# EAGLE design in4_single_v0.2_revB (EAGLE 7.6.0)
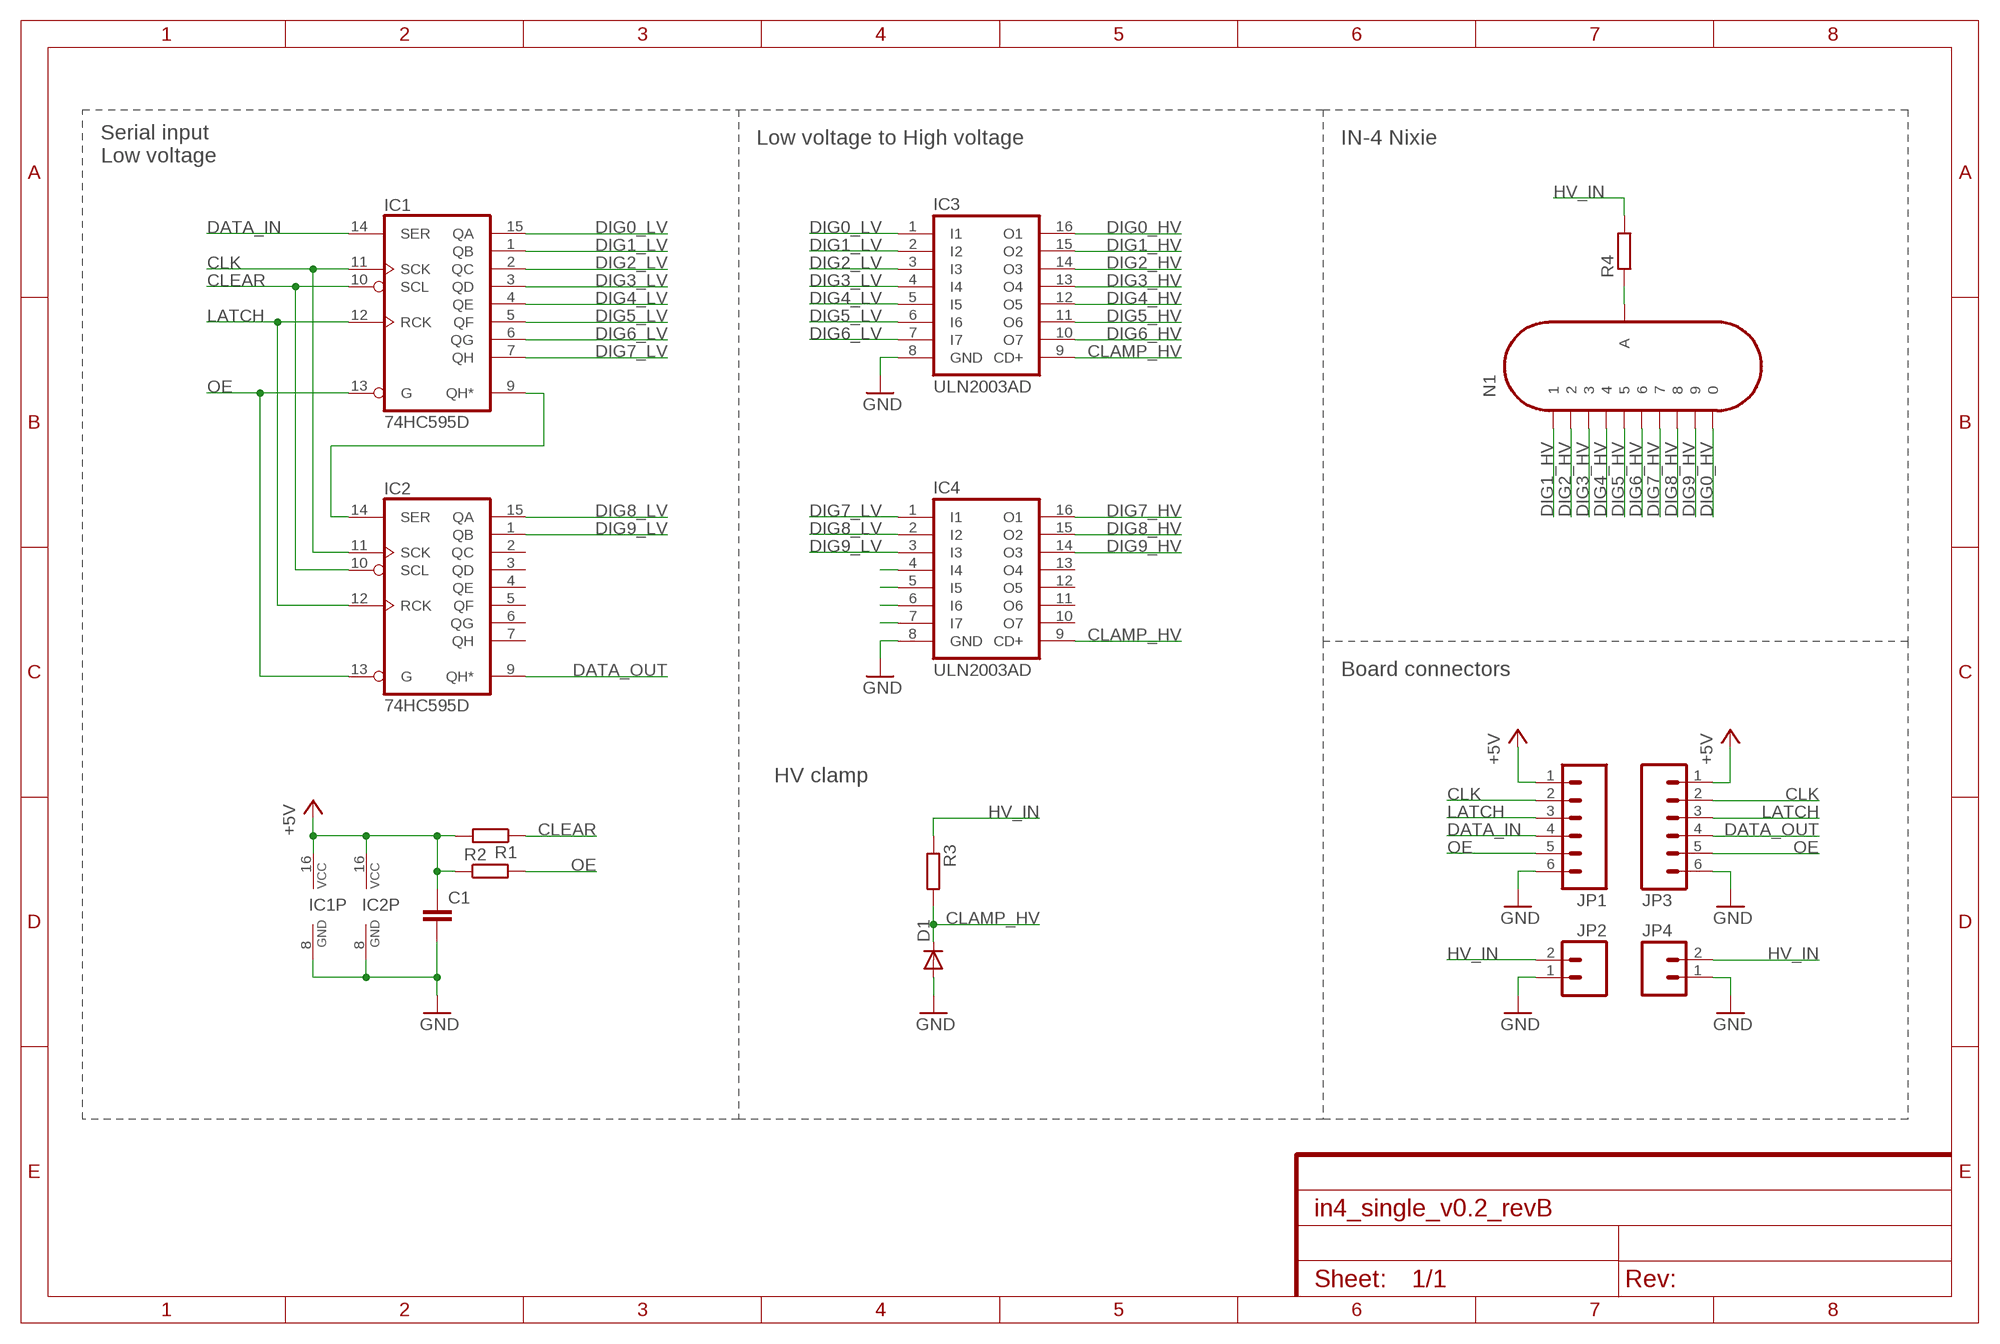
[diagram p0: schematic, sheet 1]
FRAME1 (FRAME-A4L): CNAME: IN4-SINGLE; CREVISION: 0.2 rev B; DESIGNER: Vlad Conut

## Parts
C1  C-EUC0805  [C0805]
D1  DIODE-SOD-123  [SOD-123]
IC1  74HC595D  [SO16]
IC2  74HC595D  [SO16]
IC3  ULN2003AD  [SO16]
IC4  ULN2003AD  [SO16]
JP1  M06NO_SILK_FEMALE_PTH  [1X06_NO_SILK]
JP2  M021X02_NO_SILK  [1X02_NO_SILK]
JP3  M06NO_SILK_FEMALE_PTH  [1X06_NO_SILK]
JP4  M021X02_NO_SILK  [1X02_NO_SILK]
N1  IN-4  [IN-4]
R1  R-EU_R0805  [R0805]
R2  R-EU_R0805  [R0805]
R3  R-EU_R0805  [R0805]
R4  R-EU_R1210  [R1210]

## Nets
+5V: C1.1 IC1.16(VCC) IC2.16(VCC) JP1.1 JP3.1 R1.2 R2.1
CLAMP_HV: D1.C IC3.9(CD+) IC4.9(CD+) R3.2
CLEAR: IC1.10(SCL) IC2.10(SCL) R1.1
CLK: IC1.11(SCK) IC2.11(SCK) JP1.2 JP3.2
DATA_IN: IC1.14(SER) JP1.4
DATA_OUT: IC2.9(QH*) JP3.4
DIG0_HV: IC3.16(O1) N1.8
DIG0_LV: IC1.15(QA) IC3.1(I1)
DIG1_HV: IC3.15(O2) N1.14
DIG1_LV: IC1.1(QB) IC3.2(I2)
DIG2_HV: IC3.14(O3) N1.9
DIG2_LV: IC1.2(QC) IC3.3(I3)
DIG3_HV: IC3.13(O4) N1.11
DIG3_LV: IC1.3(QD) IC3.4(I4)
DIG4_HV: IC3.12(O5) N1.1
DIG4_LV: IC1.4(QE) IC3.5(I5)
DIG5_HV: IC3.11(O6) N1.12
DIG5_LV: IC1.5(QF) IC3.6(I6)
DIG6_HV: IC3.10(O7) N1.2
DIG6_LV: IC1.6(QG) IC3.7(I7)
DIG7_HV: IC4.16(O1) N1.6
DIG7_LV: IC1.7(QH) IC4.1(I1)
DIG8_HV: IC4.15(O2) N1.3
DIG8_LV: IC2.15(QA) IC4.2(I2)
DIG9_HV: IC4.14(O3) N1.5
DIG9_LV: IC2.1(QB) IC4.3(I3)
GND: C1.2 D1.A IC1.8(GND) IC2.8(GND) IC3.8(GND) IC4.8(GND) JP1.6 JP2.1 JP3.6 JP4.1
HV_IN [HV]: JP2.2 JP4.2 R3.1 R4.2
LATCH: IC1.12(RCK) IC2.12(RCK) JP1.3 JP3.3
N$1: IC1.9(QH*) IC2.14(SER)
N$2: IC4.4(I4)
N$3: IC4.7(I7)
N$4: IC4.6(I6)
N$5: IC4.5(I5)
N$11: N1.4(A) R4.1
OE: IC1.13(G) IC2.13(G) JP1.5 JP3.5 R2.2
Unconnected: IC2.2(QC) IC2.3(QD) IC2.4(QE) IC2.5(QF) IC2.6(QG) IC2.7(QH) IC4.10(O7) IC4.11(O6) IC4.12(O5) IC4.13(O4)

## Notes on the sheet
- Low voltage to High voltage | IN-4 Nixie
- Serial input
  Low voltage
- Board connectors
- HV clamp

## Library data of the parts
C1 = rcl:C-EU: CAPACITOR, European symbol
D1 = dp_devices:DIODE: Various Diode Packages
IC1 IC2 = 74xx-eu:74*595: 8-bit SHIFT REGISTER, output latch
IC3 IC4 = uln-udn:ULN2003A: DRIVER ARRAY
JP1 JP3 = SparkFun-Connectors:M06: Header 6 Standard 6-pin 0.1" header. Use with straight break away headers (SKU : PRT-00116), right angle break away headers (PRT-00553), swiss pins (PRT-00743), machine pins (PRT-00117), and female headers (PRT-00115). Molex polarized connector foot print use with SKU : PRT-08094 with associated crimp pins and housings. NOTES ON THE VARIANTS LOCK and LOCK_LONGPADS... This footprint was designed to help hold the alignment of a through-hole component (i.e. 6-pin header) while soldering it into place. You may notice that each hole has been shifted either up or down by 0.005 of an inch from it's more standard position (which is a perfectly straight line). This slight alteration caused the pins (the squares in the middle) to touch the edges of the holes. Because they are alternating, it causes a "brace" to hold the component in place. 0.005 has proven to be the perfect amount of "off-center" position when using our standard breakaway headers. Although looks a little odd when you look at the bare footprint, once you have a header in there, the alteration is very hard to notice. Also,if you push a header all the way into place, it is covered up entirely on the bottom side. This idea of altering the position of holes to aid alignment will be further integrated into the Sparkfun Library for other footprints. It can help hold any component with 3 or more connection pins.; PROD_ID: CONN-08437
JP2 JP4 = SparkFun-Connectors:M02: Standard 2-pin 0.1" header. Use with - straight break away headers ( PRT-00116) - right angle break away headers (PRT-00553) - swiss pins (PRT-00743) - machine pins (PRT-00117) - female headers (PRT-00115) Molex polarized connector foot print use with: PRT-08233 with associated crimp pins and housings. 2.54_SCREWTERM for use with PRT-10571. 3.5mm Screw Terminal footprints for PRT-08084 5mm Screw Terminal footprints for use with PRT-08432
N1 = russian-nixies:IN-4: IN-4: large numeric topview nixie tube
R1-R3 = rcl:R-EU_: RESISTOR, European symbol
R4 = resistor:R-EU_: RESISTOR, European symbol

## Net classes
1 HV: width 0.61 mm, drill 0.33 mm, clearance 0.406 mm

## Board
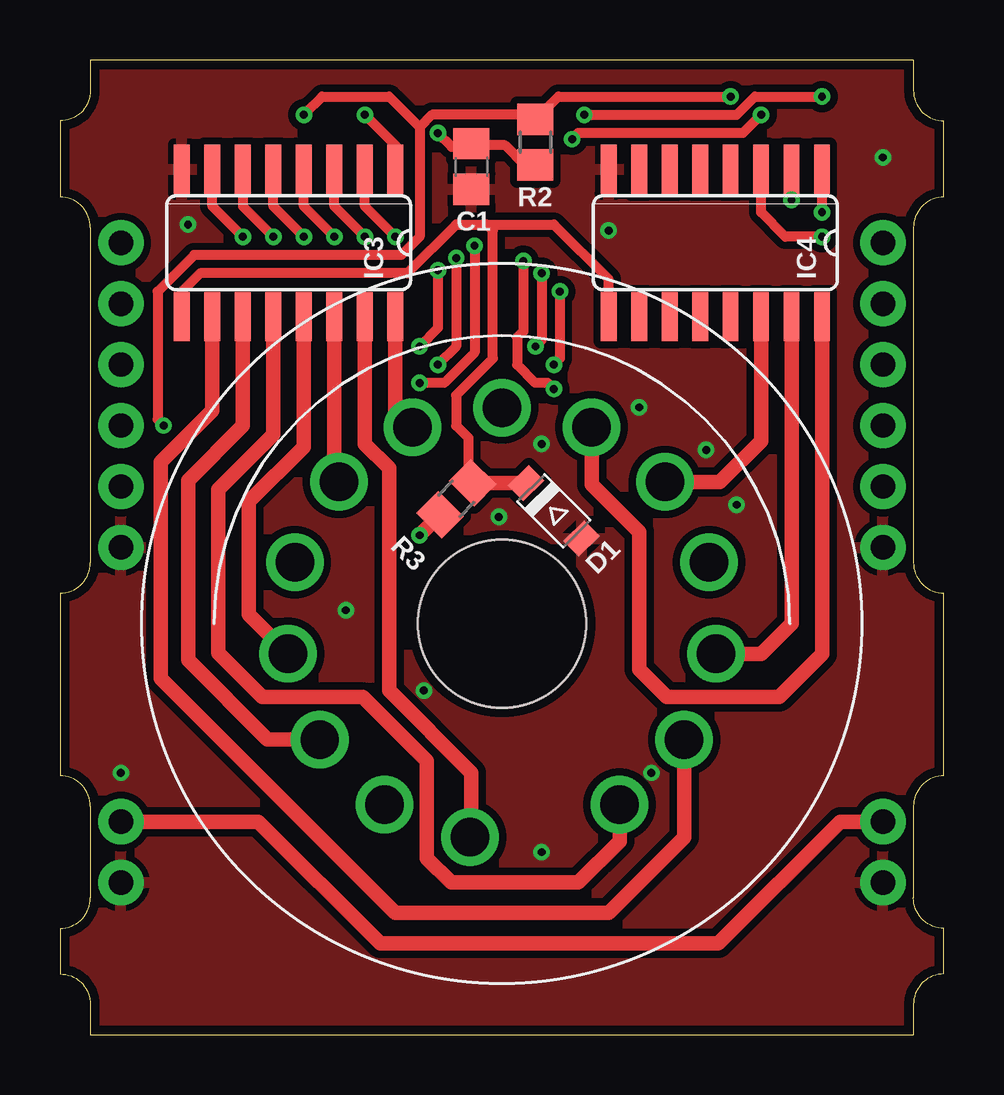
[diagram p1: board, top side]
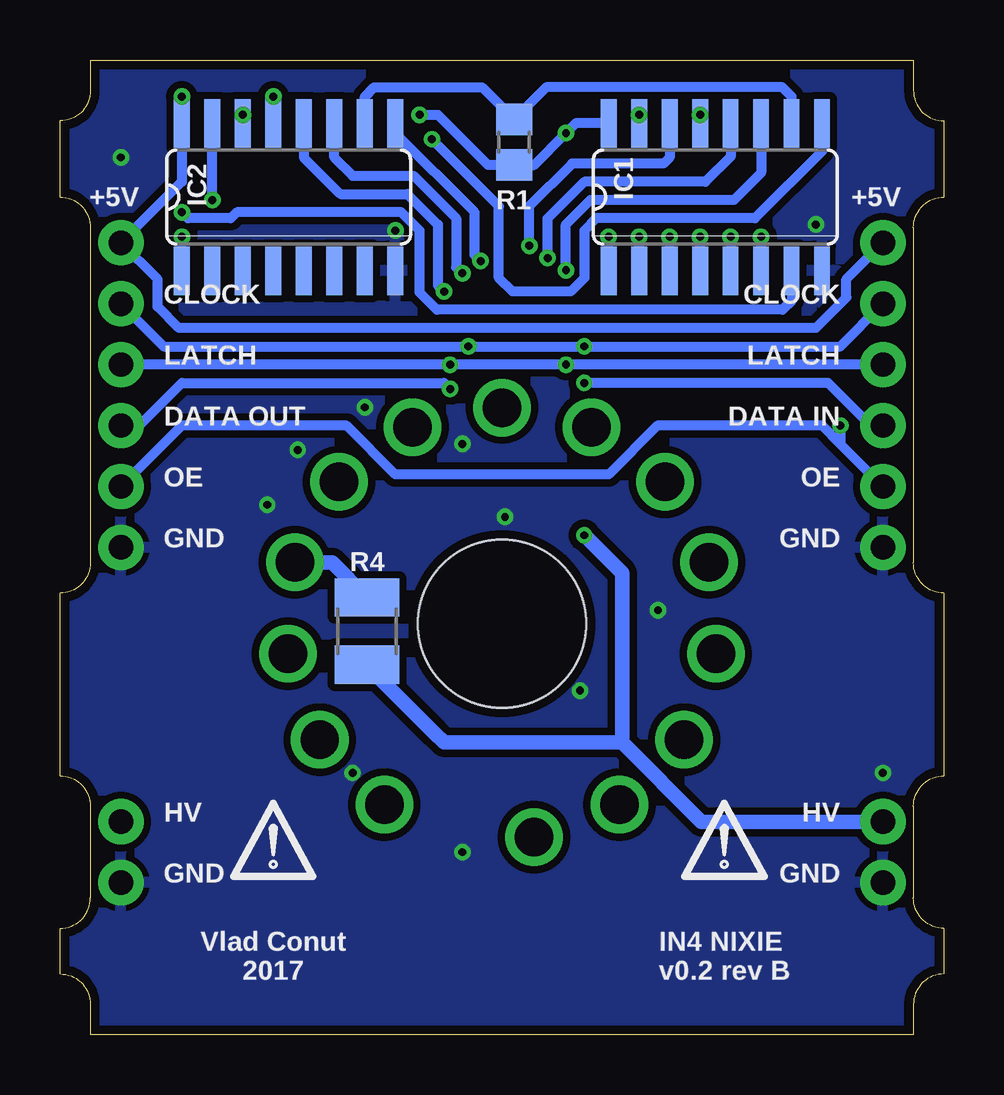
[diagram p2: board, bottom side, seen from below]

Size 36.83 x 40.64 mm. Coordinates in mm from the lower left corner, seen from the top.
Outline: 1.27,0 35.56,0 35.56,1.27 arc-90 36.83,2.54 36.83,4.45 arc-90 35.56,5.71 35.56,9.53 arc-90 36.83,10.79 36.83,18.41 arc-90 35.56,19.68 35.56,33.66 arc-90 36.83,34.92 36.83,38.1 arc-90 35.56,39.37 35.56,40.64 1.27,40.64 1.27,39.37 arc-90 0,38.1 0,34.92 arc-90 1.27,33.66 1.27,19.68 arc-90 0,18.41 0,10.79 arc-90 1.27,9.53 1.27,5.71 arc-90 0,4.45 0,2.54 arc-90 1.27,1.27 1.27,0
Copper layers (1*16): Top 0.0356mm / dielectric 1.5288mm / Bottom 0.0356mm
Design rules "OSHPARK_mod *": minimum track width 6mil, minimum drill 13mil, track to track 6mil, track to pad 6mil, pad to pad 6mil, via to via 6mil, smd to smd 0mil, copper to edge 15mil, drill to drill 6mil, minimum pad ring 10mil, minimum via ring 7mil, stop-mask expansion 3mil, vias tented up to drill 20mil, thermal gap 10mil

### Footprints (pad centres in the part's own frame; a part is rotated, then mirrored left to right if it is on the bottom)
C0805 = smd 1.3 x 1.5: 1 -0.95,0; 2 0.95,0
SOD-123 = smd 0.91 x 1.22: A 1.635,0; C -1.635,0
SO16 = smd 0.66 x 2.032: 1 -4.445,-3.073; 2 -3.175,-3.073; 3 -1.905,-3.073; 4 -0.635,-3.073; 5 0.635,-3.073; 6 1.905,-3.073; 7 3.175,-3.073; 8 4.445,-3.073; 9 4.445,3.073; 10 3.175,3.073; 11 1.905,3.073; 12 0.635,3.073; 13 -0.635,3.073; 14 -1.905,3.073; 15 -3.175,3.073; 16 -4.445,3.073
1X06_NO_SILK = drill 1.016 pad 1.88: 1 0,0; 2 2.54,0; 3 5.08,0; 4 7.62,0; 5 10.16,0; 6 12.7,0
1X02_NO_SILK = drill 1.016 pad 1.88: 1 0,0; 2 2.54,0
IN-4 = drill 1.6: 1 4.902,-7.548; 2 7.59,-4.836; 3 8.912,-1.253; 4 8.629,2.556; 5 6.792,5.904; 6 3.732,8.19; 7 0,9; 8 -3.732,8.19; 9 -6.792,5.904; 10 -8.629,2.556; 11 -8.912,-1.253; 12 -7.59,-4.836; 13 -4.902,-7.548; 14 -1.33,-8.901 | hole 7: 0,0
R0805 = smd 1.3 x 1.5: 1 -0.95,0; 2 0.95,0
R1210 = smd 1.6 x 2.7: 1 -1.4,0; 2 1.4,0

### Placement (x,y rotation side)
C1  17.14,36.2 270 top
D1  20.57,21.84 315 top
IC1  9.53,34.92 0 bottom
IC2  27.3,34.92 0 bottom
IC3  9.53,33.02 180 top
IC4  27.3,33.02 180 top
JP1  2.54,33.02 270 top
JP2  2.54,6.35 90 top
JP3  34.29,33.02 270 top
JP4  34.29,6.35 90 top
N1  18.41,17.14 0 top
R1  17.91,37.21 270 bottom
R2  19.81,37.21 90 top
R3  16.51,22.35 45 top
R4  24.04,16.83 270 bottom
U$1  [DANGER_LOGO]  27.94,7.11 0 bottom
U$2  [DANGER_LOGO]  9.14,7.11 0 bottom

### Tracks (layer width: path | path; a pad name or v marks a point on that pad's centre or on a via)
+5V  (via drill 0.33)
  Top 0.406: v15.75,37.59 16.32,37.02 C1.1 17.21,37.08 18.54,37.08 19.36,36.26 R2.1 | v21.84,38.35 28.19,38.35 28.96,39.12 v31.75,39.12
  Bottom 0.406: v21.84,38.35 21.08,38.35 18.99,36.26 R1.2 17.08,36.26 v15.75,37.59 15.34,38 IC1.16 | JP1.1 4.06,31.5 4.06,30.73 5.33,29.46 31.88,29.46 32.77,30.35 32.77,31.5 JP3.1 31.75,35.56 IC2.16 v31.75,39.12
CLAMP_HV
  Top 0.406: IC4.9 22.86,31.5 20.57,33.78 17.78,33.78 | IC3.9 5.08,30.99 5.84,31.75 14.48,31.75 16.51,33.78 17.78,33.78 | 17.78,33.78 18.03,33.53 18.03,28.19 16.51,26.67 16.51,25.4 17.02,24.89 17.02,23.19 R3.2
  Top 0.61: D1.C 17.2,23 R3.2
CLEAR
  Bottom 0.406: IC2.10 24.13,39.12 23.75,39.5 19.24,39.5 R1.1 16.57,39.5 6.73,39.5 6.35,39.12 IC1.10
CLK  (via drill 0.33)
  Top 0.406: v20.07,31.75 20.07,28.96 v19.81,28.7 | v15.75,31.88 15.75,29.46 v14.99,28.7
  Bottom 0.406: JP3.2 32.51,28.7 v19.81,28.7 v14.99,28.7 4.32,28.7 JP1.2 | v20.07,31.75 20.32,32 20.32,34.04 22.1,35.81 24.64,35.81 25.4,36.58 IC2.11 | IC1.11 7.62,35.93 8.76,34.8 14.73,34.8 15.75,33.78 v15.75,31.88
DATA_IN  (via drill 0.33)
  Top 0.406: v17.27,32.89 17.27,28.45 16,27.18 v14.99,27.18
  Bottom 0.406: JP1.4 3.05,25.4 4.83,27.18 v14.99,27.18 | IC1.14 11.43,36.58 11.68,36.32 15.49,36.32 17.27,34.54 v17.27,32.89
DATA_OUT  (via drill 0.33)
  Top 0.406: v20.57,26.92 20.32,27.18 19.81,27.18 19.05,27.94 19.05,29.08 19.3,29.34 v19.3,32.26
  Bottom 0.406: 22.86,38.1 IC2.9 22.86,37.59 19.56,34.29 19.56,32.51 v19.3,32.26 | JP3.4 33.53,25.4 31.75,27.18 20.83,27.18 v20.57,26.92
DIG0_HV
  Top 0.61: IC3.16 13.97,26.05 N1.8
DIG0_LV  (via drill 0.33)
  Top 0.406: IC3.1 13.97,37.08 v12.7,38.35
  Bottom 0.406: v12.7,38.35 IC1.15
DIG1_HV
  Top 0.61: N1.14 17.14,8.3 17.14,10.92 13.72,14.35 13.72,23.62 12.7,24.64 IC3.15
DIG1_LV  (via drill 0.33)
  Top 0.406: v13.97,33.27 12.7,34.54 IC3.2
  Bottom 0.406: 13.97,31.75 IC1.1 v13.97,33.27
DIG2_HV
  Top 0.61: IC3.14 11.43,23.24 N1.9
DIG2_LV  (via drill 0.33)
  Top 0.406: v12.7,33.27 11.43,34.54 IC3.3
  Bottom 0.406: IC1.2 v12.7,33.27
DIG3_HV
  Top 0.61: N1.11 7.87,17.52 7.87,22.23 10.16,24.51 IC3.13
DIG3_LV  (via drill 0.33)
  Top 0.406: v11.43,33.27 10.16,34.54 IC3.4
  Bottom 0.406: IC1.3 v11.43,33.27
DIG4_HV
  Top 0.61: N1.1 23.32,8.08 21.59,6.35 16.31,6.35 15.29,7.37 15.29,11.43 12.62,14.1 8.43,14.1 6.6,15.93 6.6,22.73 8.89,25.02 IC3.12
DIG4_LV  (via drill 0.33)
  Top 0.406: v10.16,33.27 8.89,34.54 IC3.5
  Bottom 0.406: IC1.4 v10.16,33.27
DIG5_HV
  Top 0.61: IC3.11 7.62,25.4 5.33,23.11 5.33,15.62 8.65,12.31 N1.12
DIG5_LV  (via drill 0.33)
  Top 0.406: IC3.6 7.62,34.54 v8.89,33.27
  Bottom 0.406: v8.89,33.27 IC1.5
DIG6_HV
  Top 0.61: IC3.10 6.35,26.04 4.19,23.88 4.19,14.86 13.97,5.08 22.86,5.08 26.01,8.23 N1.2
DIG6_LV  (via drill 0.33)
  Top 0.406: IC3.7 6.35,34.54 v7.62,33.27
  Bottom 0.406: IC1.6 v7.62,33.27
DIG7_HV
  Top 0.61: IC4.16 31.75,15.88 29.97,14.1 25.27,14.1 24.13,15.24 24.13,20.95 22.15,22.94 N1.6
DIG7_LV  (via drill 0.33)
  Top 0.406: v31.75,34.29 IC4.1
  Bottom 0.406: v31.75,34.29 31.5,34.04 29.72,34.04 29.46,34.29 22.61,34.29 21.84,33.53 21.84,30.94 21.13,30.23 6.73,30.23 6.35,30.61 IC1.7
DIG8_HV
  Top 0.61: IC4.15 30.48,17.14 29.21,15.88 27.34,15.88 N1.3
DIG8_LV  (via drill 0.33)
  Top 0.406: IC4.2 v30.48,34.8
  Bottom 0.406: v30.48,34.8 IC2.15
DIG9_HV
  Top 0.61: IC4.14 29.21,24.77 27.49,23.05 N1.5
DIG9_LV  (via drill 0.33)
  Top 0.406: IC4.3 29.21,34.29 30.23,33.27 v31.75,33.27
  Bottom 0.406: IC2.1 v31.75,33.27
GND  (via drill 0.33)
  other vias: 5.33,33.78 18.29,21.59 2.54,10.92 20.07,7.62 24.64,10.92 34.29,36.58 20.07,24.64 24.13,26.16 26.92,24.38 28.19,22.1 11.91,17.7 15.16,14.35 22.86,33.53
  pour Top (isolate 0.305, rank 6): 0,40.64 36.83,40.64 36.83,0 0,0
  pour Bottom (isolate 0.305): 0,40.64 36.83,40.64 36.83,0 0,0
HV_IN  (via drill 0.33)
  Top 0.61: JP2.2 8.26,8.89 13.34,3.81 27.43,3.81 32.51,8.89 JP4.2 | R3.1 v14.99,20.83
  Bottom 0.61: JP2.2 10.11,8.89 13.41,12.19 | 13.41,12.19 13.41,19.25 v14.99,20.83 | R4.2 24.04,15.4 21.21,12.57 20.83,12.19 13.41,12.19
LATCH  (via drill 0.33)
  Top 0.406: v20.83,30.99 20.83,28.19 v20.57,27.94 | v16.51,32.38 16.51,28.7 v15.75,27.94
  Bottom 0.406: JP1.3 v15.75,27.94 v20.57,27.94 JP3.3 | IC2.12 26.67,36.58 25.15,35.05 22.35,35.05 21.08,33.78 21.08,31.24 v20.83,30.99 | IC1.12 8.89,36.61 9.94,35.56 14.99,35.56 16.51,34.04 v16.51,32.38
N$1  (via drill 0.33)
  Top 0.406: v29.21,38.35 28.45,37.59 21.59,37.59 v21.34,37.34
  Bottom 0.406: IC1.9 5.08,36.83 7.87,34.04 14.48,34.04 14.99,33.53 14.99,31.56 15.55,30.99 17.97,30.99 18.54,31.56 18.54,34.54 v21.34,37.34 | IC2.14 v29.21,38.35
N$11
  Bottom 0.61: N1.4 25.48,19.7 R4.1
OE  (via drill 0.33)
  Top 0.406: v10.16,38.35 10.92,39.12 13.72,39.12 14.99,37.85 | v4.32,25.4 4.06,25.65 4.06,30.99 5.59,32.51 14.22,32.51 14.99,33.27 14.99,37.85 | 14.99,37.85 15.49,38.35 19.62,38.35 R2.2 20.77,39.12 v27.94,39.12
  Bottom 0.406: v10.16,38.35 IC1.13 | JP1.5 4.32,24.64 | 4.32,24.64 5.08,25.4 11.94,25.4 13.97,23.37 22.86,23.37 24.89,25.4 31.75,25.4 JP3.5 | v4.32,25.4 4.32,24.64 | v27.94,39.12 IC2.13

### Text on the board
bPlace: +5V | +5V | CLOCK | CLOCK | LATCH | LATCH | DATA IN | DATA OUT | OE | OE | GND | GND | HV | HV | GND | GND | IN4 NIXIE / v0.2 rev B | Vlad Conut / 2017